# EAGLE design DC-DC-Brick-eighth (EAGLE 8.4.3)
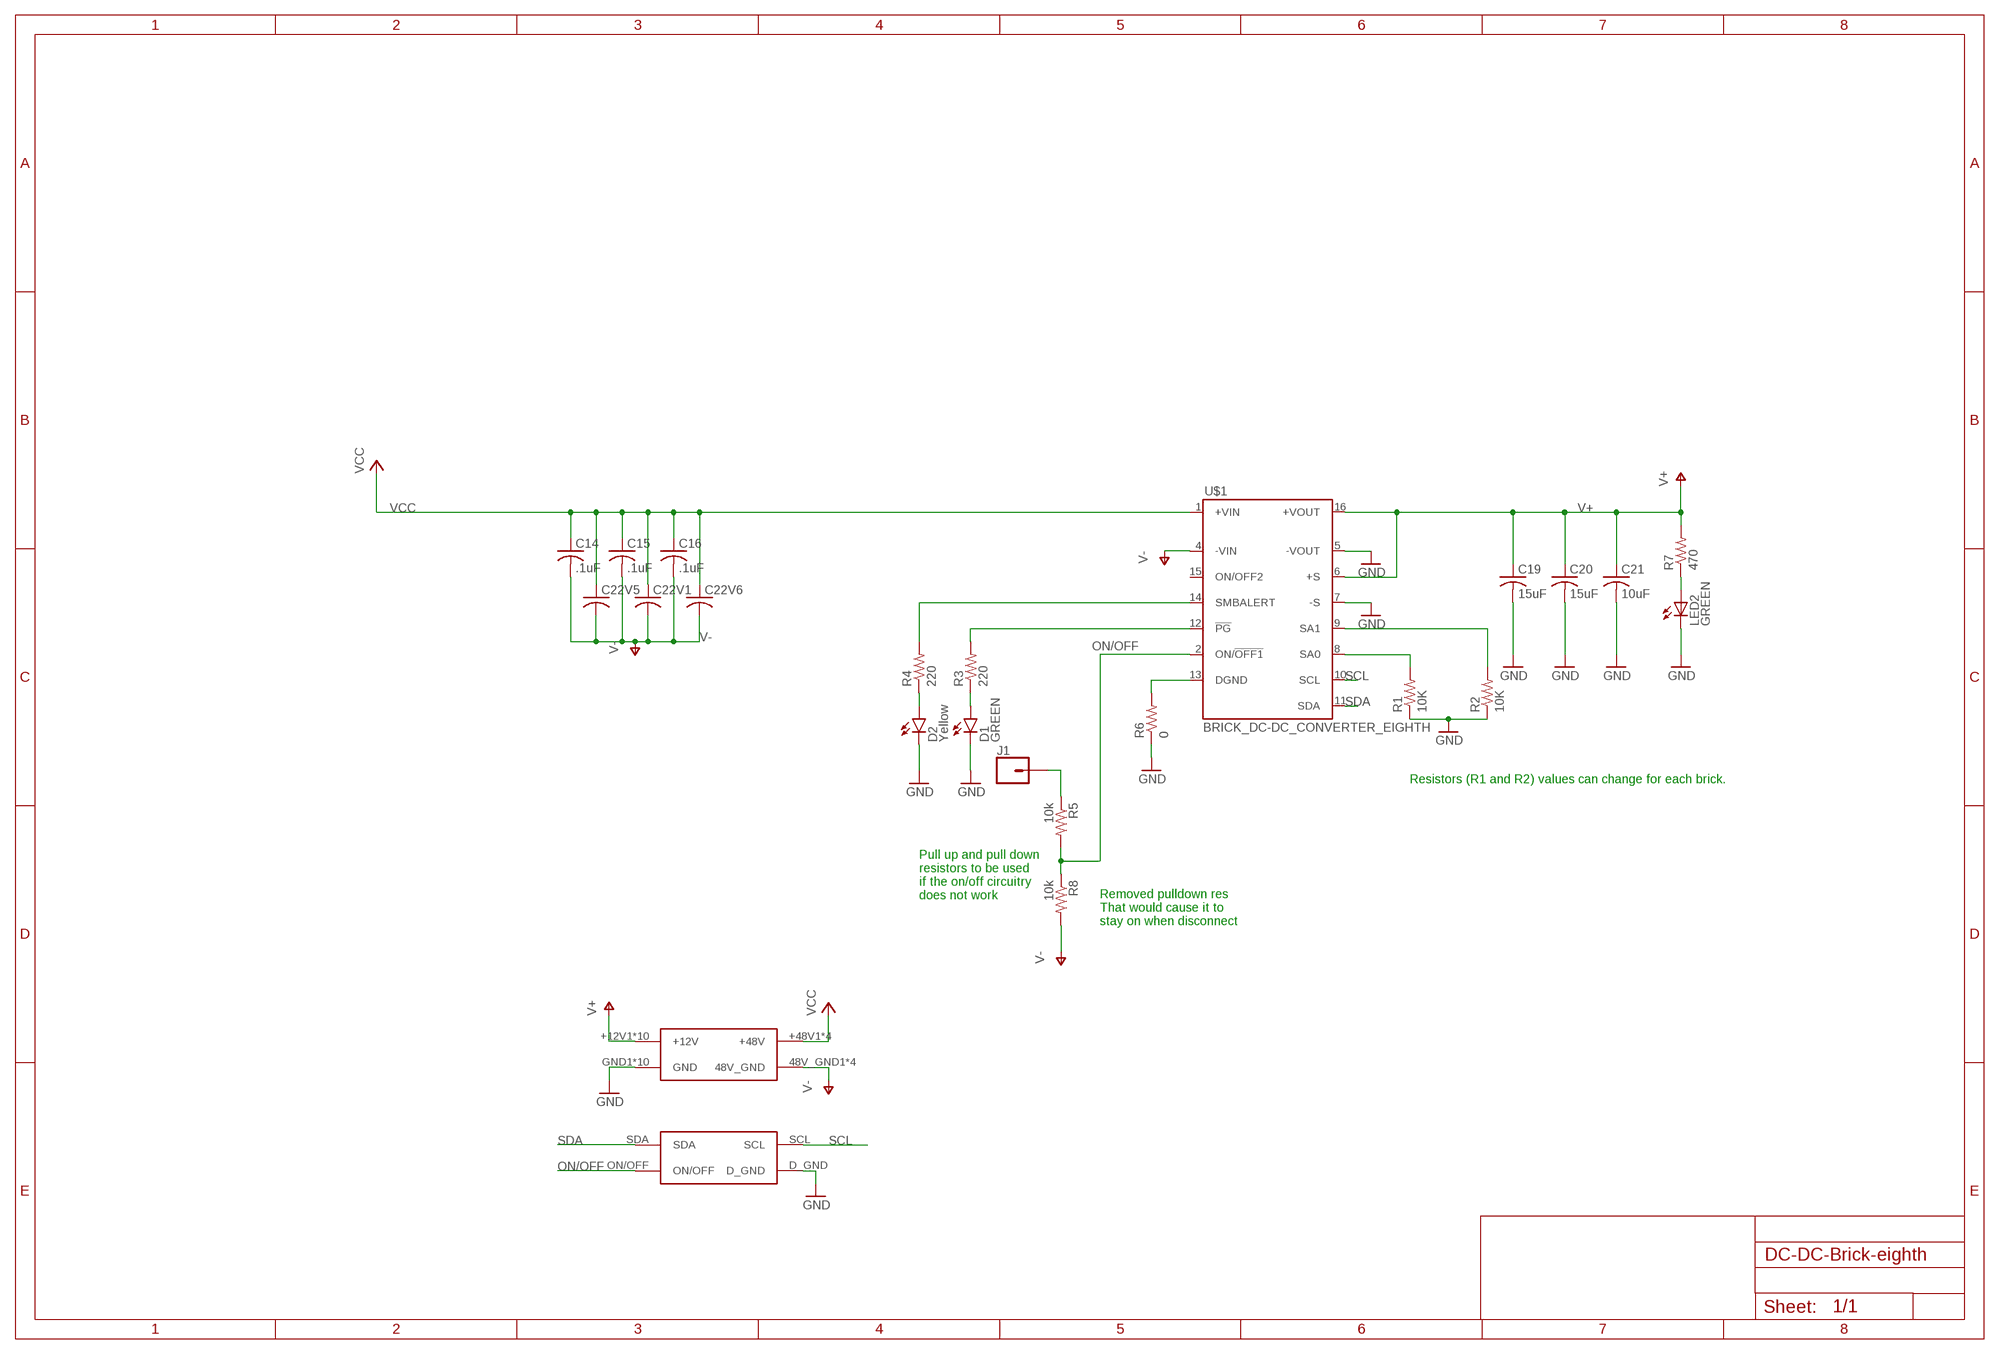
[diagram p0: schematic, sheet 1]

## Parts
C14  .1uF  C-USC0603  [C0603]
C15  .1uF  C-USC0603  [C0603]
C16  .1uF  C-USC0603  [C0603]
C19  15uF  C-USC3216  [C3216]
C20  15uF  C-USC3216  [C3216]
C21  10uF  C-USC0603  [C0603]
C22V1  EXTENDED_PAD_CAPACITOR  [MODIFIED-NICHICON-UX-8X10]
C22V5  EXTENDED_PAD_CAPACITOR  [MODIFIED-NICHICON-UX-8X10]
C22V6  EXTENDED_PAD_CAPACITOR  [MODIFIED-NICHICON-UX-8X10]
D1  GREEN  LED-GREEN0603  [LED-0603]
D2  Yellow  LED-YELLOW0603  [LED-0603]
J1  CONN_01  [1X01]
LED2  GREEN  LED0603  [LED-0603]
R1  10K  10KOHM-1/10W-1%(0603)0603  [0603-RES]
R2  10K  10KOHM-1/10W-1%(0603)0603  [0603-RES]
R3  220  1KOHM-1/10W-1%(0603)  [0603-RES]
R4  220  1KOHM-1/10W-1%(0603)  [0603-RES]
R5  10k  1KOHM-1/10W-1%(0603)  [0603-RES]
R6  0  1KOHM-1/10W-1%(0603)  [0603-RES]
R7  470  470OHM1/10W1%(0603)  [0603-RES]
R8  10k  1KOHM-1/10W-1%(0603)  [0603-RES]
U$1  BRICK_DC-DC_CONVERTER_EIGHTH  [BRICK_DC-DC_CONVERTER_EIGHTH]
U$4  BRICK_TO_POWER_DIST_WHOLE  [BRICK_TO_POWER_DIST_WHOLE]

## Nets
GND: C19.2 C20.2 C21.2 D1.C D2.C LED2.C R1.1 R2.1 R6.1 U$1.5(-VOUT) U$1.7(-S) U$4.D_GND U$4.GND1(GND) U$4.GND2(GND) U$4.GND3(GND) U$4.GND4(GND) U$4.GND5(GND) U$4.GND6(GND) U$4.GND7(GND) U$4.GND8(GND) U$4.GND9(GND) U$4.GND10(GND)
N$1: R2.2 U$1.9(SA1)
N$2: R1.2 U$1.8(SA0)
N$3: R6.2 U$1.13(DGND)
N$4: D1.A R3.1
N$5: D2.A R4.1
N$6: R4.2 U$1.14(SMBALERT)
N$7: R3.2 U$1.12(!PG)
N$8: J1.1 R5.1
N$12: LED2.A R7.1
ON/OFF: R5.2 R8.1 U$1.2(ON/!OFF1) U$4.ON/OFF
SCL: U$1.10(SCL) U$4.SCL
SDA: U$1.11(SDA) U$4.SDA
V+: C19.1 C20.1 C21.1 R7.2 U$1.6(+S) U$1.16(+VOUT) U$4.+12V1(+12V) U$4.+12V2(+12V) U$4.+12V3(+12V) U$4.+12V4(+12V) U$4.+12V5(+12V) U$4.+12V6(+12V) U$4.+12V7(+12V) U$4.+12V8(+12V) U$4.+12V9(+12V) U$4.+12V10(+12V)
V-: C14.2 C15.2 C16.2 C22V1.P$1 C22V5.P$1 C22V6.P$1 R8.2 U$1.4(-VIN) U$4.48V_GND1(48V_GND) U$4.48V_GND2(48V_GND) U$4.48V_GND3(48V_GND) U$4.48V_GND4(48V_GND)
VCC: C14.1 C15.1 C16.1 C22V1.P$3 C22V5.P$3 C22V6.P$3 U$1.1(+VIN) U$4.+48V1(+48V) U$4.+48V2(+48V) U$4.+48V3(+48V) U$4.+48V4(+48V)
Unconnected: U$1.15(ON/OFF2)

## Notes on the sheet
- Resistors (R1 and R2) values can change for each brick.
- Pull up and pull down
  resistors to be used
  if the on/off circuitry
  does not work
- Removed pulldown res
  That would cause it to
  stay on when disconnect

## Library data of the parts
C14-C16 C19-C21 = rcl:C-US: CAPACITOR, American symbol
C22V1 C22V5 C22V6 = PowerComponents:EXTENDED_PAD_CAPACITOR: This is an updated version of the capacitor from package: NICHICON-UX-8X10, Library: ux-capacitor. The old capacitor that was used didnt have enough space to solder on a 22uF capacitor efectivly so this one has longer and slightly wider pads.
D1 = SparkFun-LED:LED-GREEN: Various green LEDs Green LEDs used in SFE Production 0603- DIO-00821 LARGE- DIO-00862 LILYPAD- DIO-09910; PROD_ID: DIO-00821
D2 = SparkFun-LED:LED-YELLOW: Yellow SMD LEDs LilyPad 1206- DIO-09909 0603- DIO-09003 "SMART" means more efficient and expensive; PROD_ID: DIO-09003
J1 = SparkFun-Connectors:CONN_01: Single connection point. Often used as Generic Header-pin footprint for 0.1 inch spaced/style header connections On any of the 0.1 inch spaced packages, you can populate with these: Break Away Headers - Straight <https://www.sparkfun.com/products/116> (PRT-00116) Break Away Male Headers - Right Angle <https://www.sparkfun.com/products/553> (PRT-00553) Female Headers <https://www.sparkfun.com/products/115> (PRT-00115) Break Away Headers - Machine Pin <https://www.sparkfun.com/products/117> (PRT-00117) Break Away Female Headers - Swiss Machine Pin <https://www.sparkfun.com/products/743> (PRT-00743) This device is also useful as a general connection point to wire up your design to another part of your project. Our various solder wires solder well into these plated through hole pads. Hook-Up Wire - Assortment (Stranded, 22 AWG) <https://www.sparkfun.com/products/11375> (PRT-11375) Hook-Up Wire - Assortment (Solid Core, 22 AWG) <https://www.sparkfun.com/products/11367> (PRT-11367) View the entire wire category on our website here <https://www.sparkfun.com/categories/141> Special notes: SMTSO-256-ET is a "flush mount" nut for a 4-40 screw. We mostly use this on specialty testbeds; it is a nice way to connect hardware to your PCB at an adjustable hieght. Also note, the SNAP packages are for using a snappable style connector. We sell a baggie of snaps and they are also used on two LilyPad designs: Snap Assortment - 30 pack (male and female) <https://www.sparkfun.com/products/11347> (DEV-11347) LilyPad Arduino SimpleSnap <https://www.sparkfun.com/products/10941> (DEV-10941) LilyPad SimpleSnap Protoboard <https://www.sparkfun.com/products/10940> (DEV-10940)
LED2 = SparkFun:LED: LEDs Standard schematic elements and footprints for 5mm, 3mm, 1206, and 0603 sized LEDs. 5mm - Spark Fun Electronics SKU : COM-00529 (and others); BOM: INCLUDE; PARTNO: 160-1446-1-ND
R1 R2 = SparkFun-Resistors:10KOHM-1/10W-1%(0603): RES-00824; PROD_ID: RES-00824
R3-R6 R8 = SparkFun-Resistors:1KOHM-1/10W-1%(0603): RES-07856; PROD_ID: RES-07856; VALUE: 1K
R7 = SparkFun-Resistors:470OHM1/10W1%(0603): RES-07869; PROD_ID: RES-07869
U$1 = PowerComponents:BRICK_DC-DC_CONVERTER_EIGHTH
U$4 = MotherBoardParts2:BRICK_TO_POWER_DIST_WHOLE

## Net classes
1 I2C: width 0.254 mm

## Board
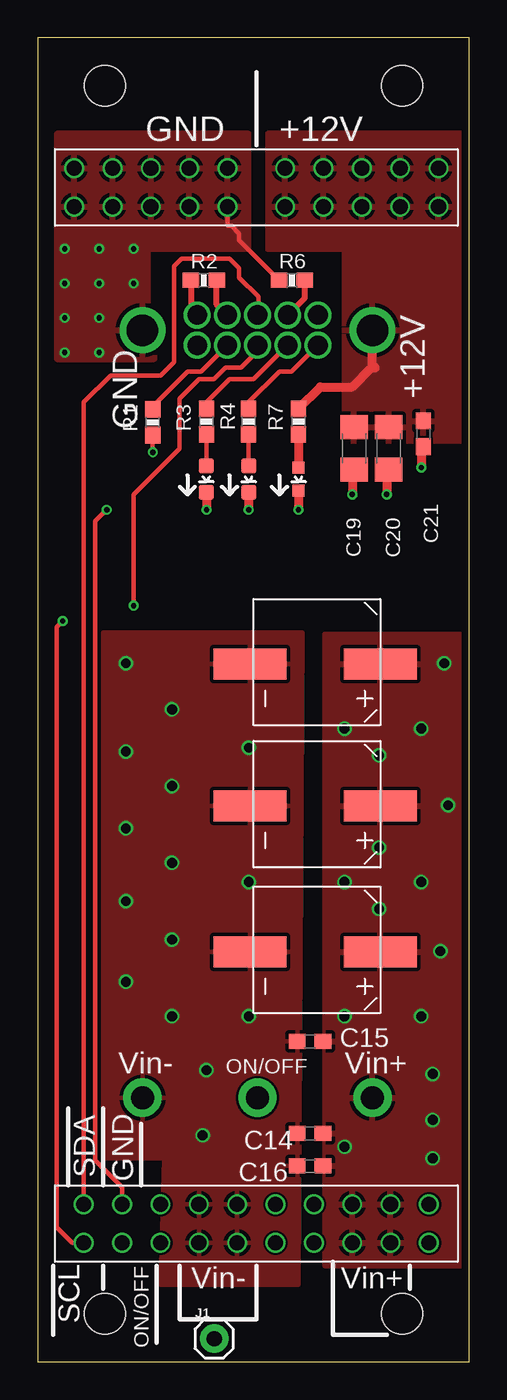
[diagram p1: board, top side]
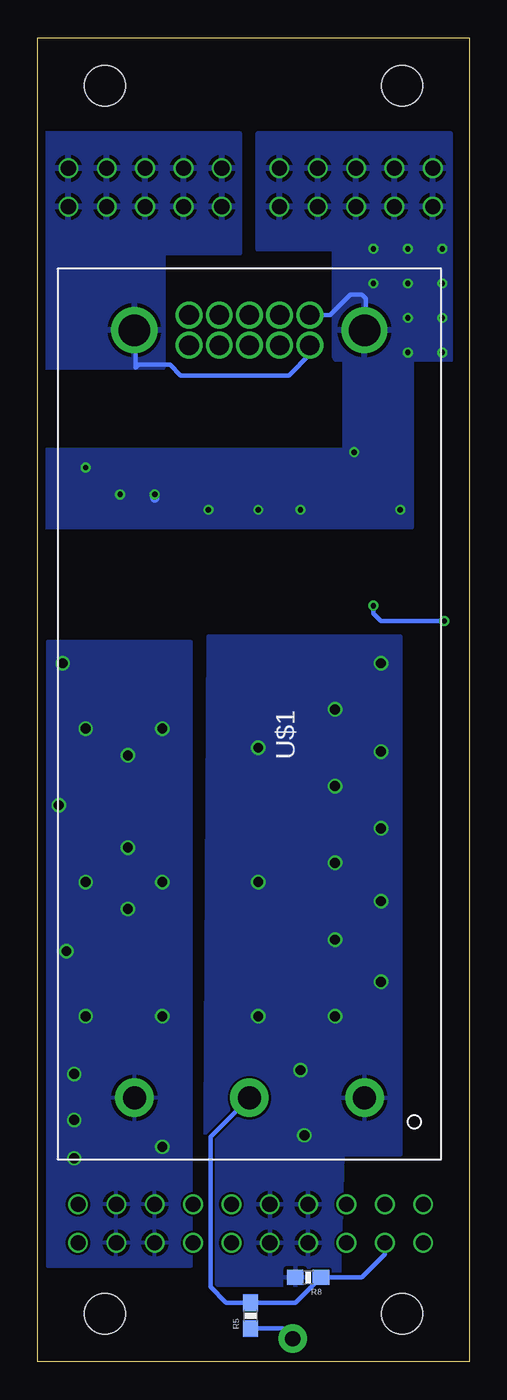
[diagram p2: board, bottom side, seen from below]

Size 28.57 x 87.63 mm. Coordinates in mm from the lower left corner, seen from the top.
Outline: 0,0 28.57,0 28.57,87.63 0,87.63 0,0
Copper layers (1*16): Top 0.035mm / dielectric 1.6mm / Bottom 0.035mm
Design rules "Elecrow_2-layer_PCB_eagle_rule *": minimum track width 6mil, minimum drill 12mil, track to track 6mil, track to pad 6mil, pad to pad 6mil, via to via 8mil, smd to smd 0mil, copper to edge 20mil, drill to drill 10mil, minimum pad ring 6mil, minimum via ring 6mil, stop-mask expansion 0mil, vias tented up to drill 100mil, thermal gap 10mil
Holes 2.69 mm at 4.45,84.45 24.13,84.45 24.13,3.17 4.45,3.17

### Footprints (pad centres in the part's own frame; a part is rotated, then mirrored left to right if it is on the bottom)
C0603 = smd 1.1 x 1: 1 -0.85,0; 2 0.85,0
C3216 = smd 1.6 x 1.8: 1 -1.4,0; 2 1.4,0
MODIFIED-NICHICON-UX-8X10 = smd 2.032 x 4.826: P$1 4.318,-0.254; P$3 4.318,8.382
LED-0603 = smd 1 x 1: A 0,-0.877; C 0,0.877
1X01 = drill 1.016 pad 1.88: 1 0,0
LED-0603' = smd 0.8 x 0.8: A 0,-0.75; C 0,0.75
0603-RES = smd 1.1 x 1: 1 -0.85,0; 2 0.85,0
BRICK_DC-DC_CONVERTER_EIGHTH = drill 1.524 pad 2.54: 1 -25.4,7.62; 2 -25.4,0; 4 -25.4,-7.62 | drill 2.083 pad 3.048: 5 25.4,-7.62; 16 25.4,7.62 | drill 1.295 pad 1.778: 6 24.4,-4; 7 26.4,-4; 8 24.4,-2; 9 26.4,-2; 10 24.4,0; 11 26.4,0; 12 24.4,2; 13 26.4,2; 14 24.4,4; 15 26.4,4
BRICK_TO_POWER_DIST_WHOLE = drill 1: 1 12.065,-49.53; 2 12.065,-52.07; 48V_GND1 4.445,-49.53; 48V_GND2 6.985,-49.53; 48V_GND3 4.445,-52.07; 48V_GND4 6.985,-52.07; +12V1 10.16,19.05; +12V2 12.7,19.05; +12V3 15.24,19.05; +12V4 17.78,19.05; +12V5 20.32,19.05; +12V6 10.16,16.51; +12V7 12.7,16.51; +12V8 15.24,16.51; +12V9 17.78,16.51; +12V10 20.32,16.51; +48V1 14.605,-49.53; +48V2 17.145,-49.53; +48V3 14.605,-52.07; +48V4 17.145,-52.07; D_GND -0.635,-49.53; GND1 -3.81,19.05; GND2 -1.27,19.05; GND3 1.27,19.05; GND4 3.81,19.05; GND5 6.35,19.05; GND6 -3.81,16.51; GND7 -1.27,16.51; GND8 1.27,16.51; GND9 3.81,16.51; GND10 6.35,16.51; ON/OFF -0.635,-52.07; P$3 1.905,-52.07; P$18 1.905,-49.53; P$31 9.525,-52.07; P$35 19.685,-52.07; P$36 9.525,-49.53; P$40 19.685,-49.53; SCL -3.175,-52.07; SDA -3.175,-49.53

### Placement (x,y rotation side)
C14  18.03,15.11 180 top
C15  18.03,21.21 180 top
C16  18.03,12.95 180 top
C19  20.95,60.45 270 top
C20  23.24,60.45 270 top
C21  25.53,61.42 270 top
C22V1  14.3,50.5 270 top
C22V5  14.3,41.1 270 top
C22V6  14.3,31.45 270 top
D1  11.18,58.42 180 top
D2  13.97,58.42 180 top
J1  11.68,1.52 0 top
LED2  GREEN  [LED-0603']  17.27,58.42 180 top
R1  7.62,62.18 90 top
R2  11,71.58 0 top
R3  11.18,62.23 90 top
R4  13.97,62.23 90 top
R5  14.48,3.05 90 bottom
R6  16.84,71.58 0 top
R7  17.27,62.23 90 top
R8  10.67,5.59 180 bottom
U$1  14.55,42.88 90 bottom
U$4  6.22,59.94 0 top

### Tracks (layer width: path | path; a pad name or v marks a point on that pad's centre or on a via)
GND  (via drill 0.35)
  Top 0.305: U$4.D_GND 5.59,11.56 3.81,13.34 3.81,55.63 v4.57,56.39 | R6.1 13.34,74.23 13.34,74.68 12.83,75.18 12.57,75.18 U$4.GND10 | R1.1 v7.62,60.2
  Top 0.406: 6.93,68.36 U$1.5 | R2.1 10.15,69.68 U$1.7 | 15.65,71.58 R6.1
  Top 0.61: C19.2 20.83,58.92 v20.83,57.4 | C20.2 23.11,58.92 v23.11,57.4 | C21.2 25.4,60.44 v25.4,59.18 | D1.C v11.18,56.39 | D2.C v13.97,56.39 | LED2.C v17.27,56.39
  Bottom 0.305: U$1.7 9.21,69.28 7.87,70.61 7.11,70.61 6.86,70.36 6.86,68.35 U$1.5
  Bottom 0.61: 20.83,57.15 v20.83,57.4
  other vias: 1.78,66.8 1.78,69.09 1.78,71.37 1.78,73.66 4.06,73.66 4.06,71.37 4.06,69.09 4.06,66.8 6.35,73.66 6.35,71.37
  pour Top (rank 6): 1.27,81.28 1.27,66.37 7.72,66.37 7.98,66.8 7.98,69.11 7.32,69.77 7.32,73.66 13.97,73.66 13.97,81.28
  pour Bottom (rank 6): 1.27,81.28 1.27,66.32 8.79,66.34 8.89,66.47 8.89,73.66 13.97,73.66 13.97,81.28
  pour Bottom (rank 6): 3.81,70.48 8.26,70.48 8.26,60.33 28.07,60.33 28.07,55.24 3.81,55.24
N$1
  Top 0.406: U$1.9 11.85,69.98 R2.2
N$2
  Top 0.305: U$1.8 10.81,65.53 9.91,65.53 7.66,63.28 R1.2
N$3
  Top 0.406: U$1.13 17.69,70.41 R6.2
N$4
  Top 0.305: R3.1 D1.A
N$5
  Top 0.305: R4.1 D2.A
N$6
  Top 0.305: U$1.14 16.81,65.53 16,65.53 13.97,63.5 R4.2
N$7
  Top 0.305: U$1.12 14.3,65.02 12.7,65.02 11.18,63.5 R3.2
N$8
  Bottom 0.305: R5.1 12.36,2.2 J1.1
N$12
  Top 0.61: R7.1 LED2.A
ON/OFF
  Bottom 0.305: U$1.2 17.14,14.88 17.14,4.95 16.09,3.9 R5.2 11.51,3.9 11.26,4.15 | U$4.ON/OFF 5.59,7.11 7.11,5.59 R8.1 11.26,4.15 | 11.26,4.15 11.34,4.06
SCL  (via drill 0.35)
  Top 0.305: U$4.SCL 2.29,7.87 1.27,8.89 1.27,48.64 v1.65,49.02 | v6.35,50.04 6.35,57.4 9.4,60.45 9.4,63.75 10.67,65.02 11.68,65.02 12.45,65.79 13.46,65.79 14.55,66.88 U$1.10
  Bottom 0.305: v1.65,49.02 5.84,49.02 6.35,49.53 v6.35,50.04
SDA
  Top 0.305: U$1.11 14.61,69.33 14.61,70.48 13.34,71.75 13.34,72.39 12.7,73.03 9.53,73.03 9.02,72.52 9.02,66.17 8.13,65.28 4.83,65.28 3.05,63.5 U$4.SDA
V+
  Top 0.61: R7.2 18.71,64.52 20.83,64.52 22.1,65.79 22.35,65.79 22.17,65.96 U$1.16
  Bottom 0.305: U$1.6 10.55,66.69 11.25,65.99 11.25,65.96 11.94,65.28 19.1,65.28 19.81,65.99 19.89,65.99 21.89,65.99 22.1,65.79 22.1,68.2 U$1.16
  pour Bottom: 15.24,81.28 15.24,73.66 20.32,73.66 20.32,66.04 28.19,66.09 28.19,81.28
  pour Top: 20.32,60.96 28.19,60.96 28.19,81.28 15.24,81.28 15.24,73.66 20.32,73.66
  pour Bottom: 15.24,81.03 15.24,73.41 20.32,73.41 20.32,65.79 28.19,65.84 28.19,81.03
V-  (via drill 0.65)
  other vias: 8.89,22.86 8.89,27.94 8.89,33.02 8.89,38.1 8.89,43.18 13.97,40.64 13.97,31.75 13.97,22.86 5.84,46.23 5.84,40.39 5.84,35.31 5.84,30.48 5.84,25.15 10.92,14.99 11.18,19.3
  pour Bottom: 8.64,5.08 17.53,5.08 17.27,48.01 4.57,48.01 4.57,13.72 8.38,13.72
  pour Top: 8.13,5.08 17.27,5.08 17.53,48.26 4.32,48.26 4.32,13.46 8.38,13.46
VCC  (via drill 0.65)
  other vias: 20.32,22.86 20.32,31.75 20.32,41.91 25.4,41.91 25.4,31.75 25.4,22.86 26.92,46.23 27.18,36.83 22.61,34.04 22.61,40.13 22.61,29.97 26.67,27.18 26.16,19.05 26.16,16 26.16,13.46 20.32,14.22
  pour Top: 19.05,6.35 19.05,48.13 28.57,48.13 28.57,6.35
  pour Bottom: 18.41,6.35 18.41,47.62 27.94,47.62 27.94,6.35

### Text on the board
tPlace: GND | +12V | +12V | GND | Vin- | ON/OFF | Vin+ | SDA | GND | ON/OFF | Vin- | Vin+ | SCL